# EAGLE design M661X (EAGLE 6.6.0)
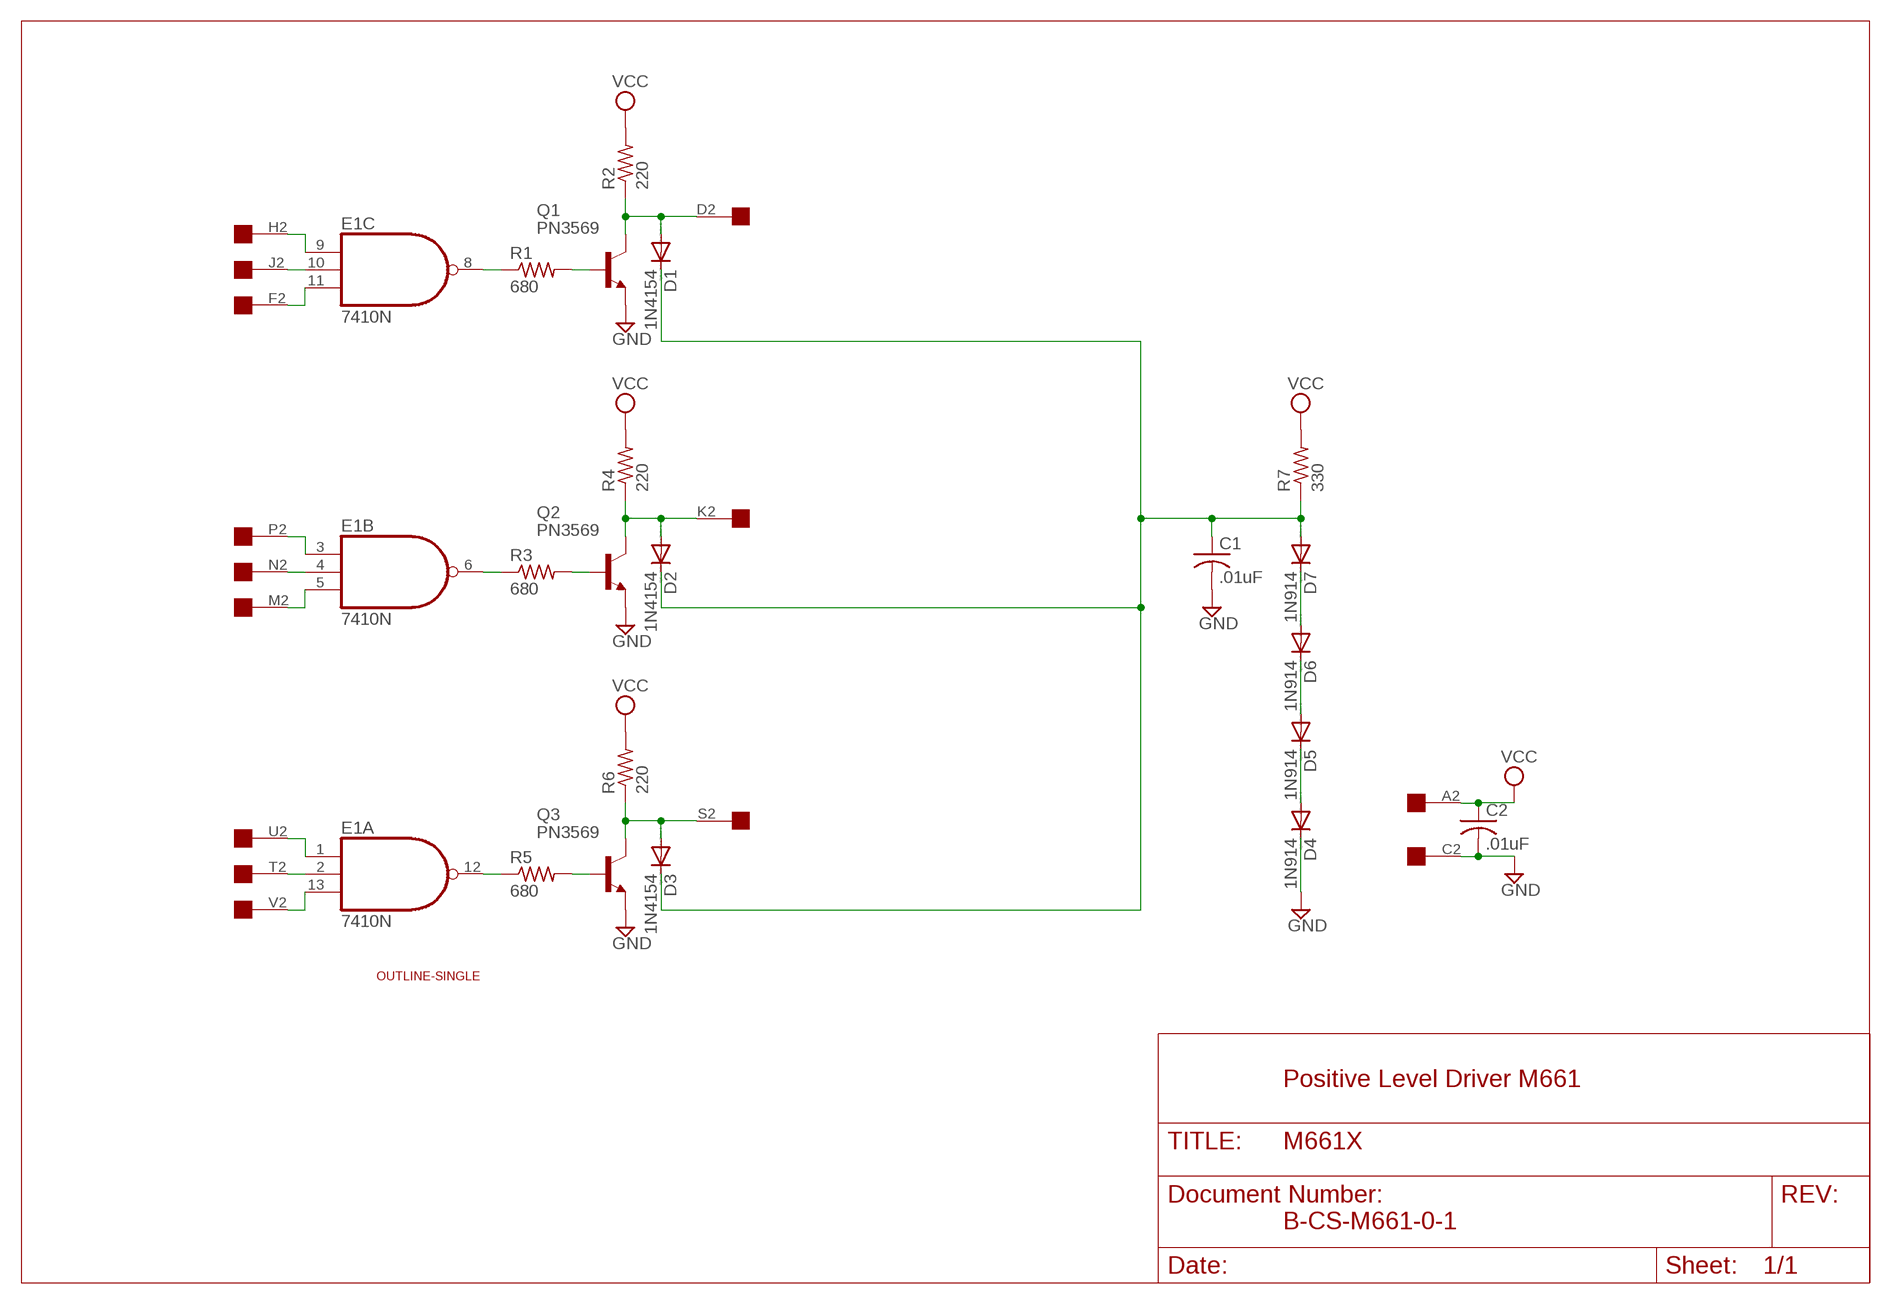
[diagram p0: schematic, sheet 1]

## Parts
C1  .01uF  C-US050-025X075  [C050-025X075]
C2  .01uF  C-US050-025X075  [C050-025X075]
D1  1N4154  1N4148DO35-10  [DO35-10]
D2  1N4154  1N4148DO35-10  [DO35-10]
D3  1N4154  1N4148DO35-10  [DO35-10]
D4  1N914  1N4148DO35-10  [DO35-10]
D5  1N914  1N4148DO35-10  [DO35-10]
D6  1N914  1N4148DO35-10  [DO35-10]
D7  1N914  1N4148DO35-10  [DO35-10]
E1  7410N  [DIL14]
Q1  PN3569  2N2219  [TO5]
Q2  PN3569  2N2219  [TO5]
Q3  PN3569  2N2219  [TO5]
R1  680  R-US_0207/10  [0207/10]
R2  220  R-US_0207/10  [0207/10]
R3  680  R-US_0207/10  [0207/10]
R4  220  R-US_0207/10  [0207/10]
R5  680  R-US_0207/10  [0207/10]
R6  220  R-US_0207/10  [0207/10]
R7  330  R-US_0207/10  [0207/10]
U$1  OUTLINE-SINGLE  [SINGLE]
U$3  EDGE-1  [EDGE-CON1]

## Nets
GND [Supply]: C1.2 C2.2 D4.C Q1.1(E) Q2.1(E) Q3.1(E) U$3.C2
N$1: E1.10(C:I1) U$3.J2
N$2: E1.9(C:I0) U$3.H2
N$3: E1.8(C:O) R1.1
N$4: Q1.2(B) R1.2
N$5: E1.4(B:I1) U$3.N2
N$6: D1.A Q1.3(C) R2.1 U$3.D2
N$7: E1.2(A:I1) U$3.T2
N$8: E1.1(A:I0) U$3.U2
N$9: E1.3(B:I0) U$3.P2
N$10: E1.6(B:O) R3.1
N$11: D2.A Q2.3(C) R4.1 U$3.K2
N$12: C1.1 D1.C D2.C D3.C D7.A R7.1
N$13: D4.A D5.C
N$14: D5.A D6.C
N$15: E1.5(B:I2) U$3.M2
N$16: Q2.2(B) R3.2
N$17: E1.12(A:O) R5.1
N$18: D3.A Q3.3(C) R6.1 U$3.S2
N$19: D6.A D7.C
N$20: E1.11(C:I2) U$3.F2
N$22: E1.13(A:I2) U$3.V2
N$23: Q3.2(B) R5.2
VCC [Supply]: C2.1 R2.2 R4.2 R6.2 R7.2 U$3.A2
Unconnected: U$3.B2 U$3.E2 U$3.L2 U$3.R2

## Notes on the sheet
- Positive Level Driver M661
- B-CS-M661-0-1

## Power pins joined to a net without a drawn wire
GND: E1.7(P:GND)
VCC: E1.14(P:VCC)

## Library data of the parts
C1 C2 = rcl:C-US: CAPACITOR, American symbol
D1-D7 = diode:1N4148: DIODE high speed (Philips)
E1 = 74xx-us:74*10: Triple 3-input NAND gate
Q1-Q3 = transistor-npn:2N2219: NPN Transistor
R1-R7 = rcl:R-US_: RESISTOR, American symbol
U$1 = dec-con:OUTLINE-*: Board outlines for DEC boards.
U$3 = dec-con:EDGE-1: Single-Sided DEC Edge Connector -- (side 2)

## Net classes
1 Supply: width 0.813 mm

## Board
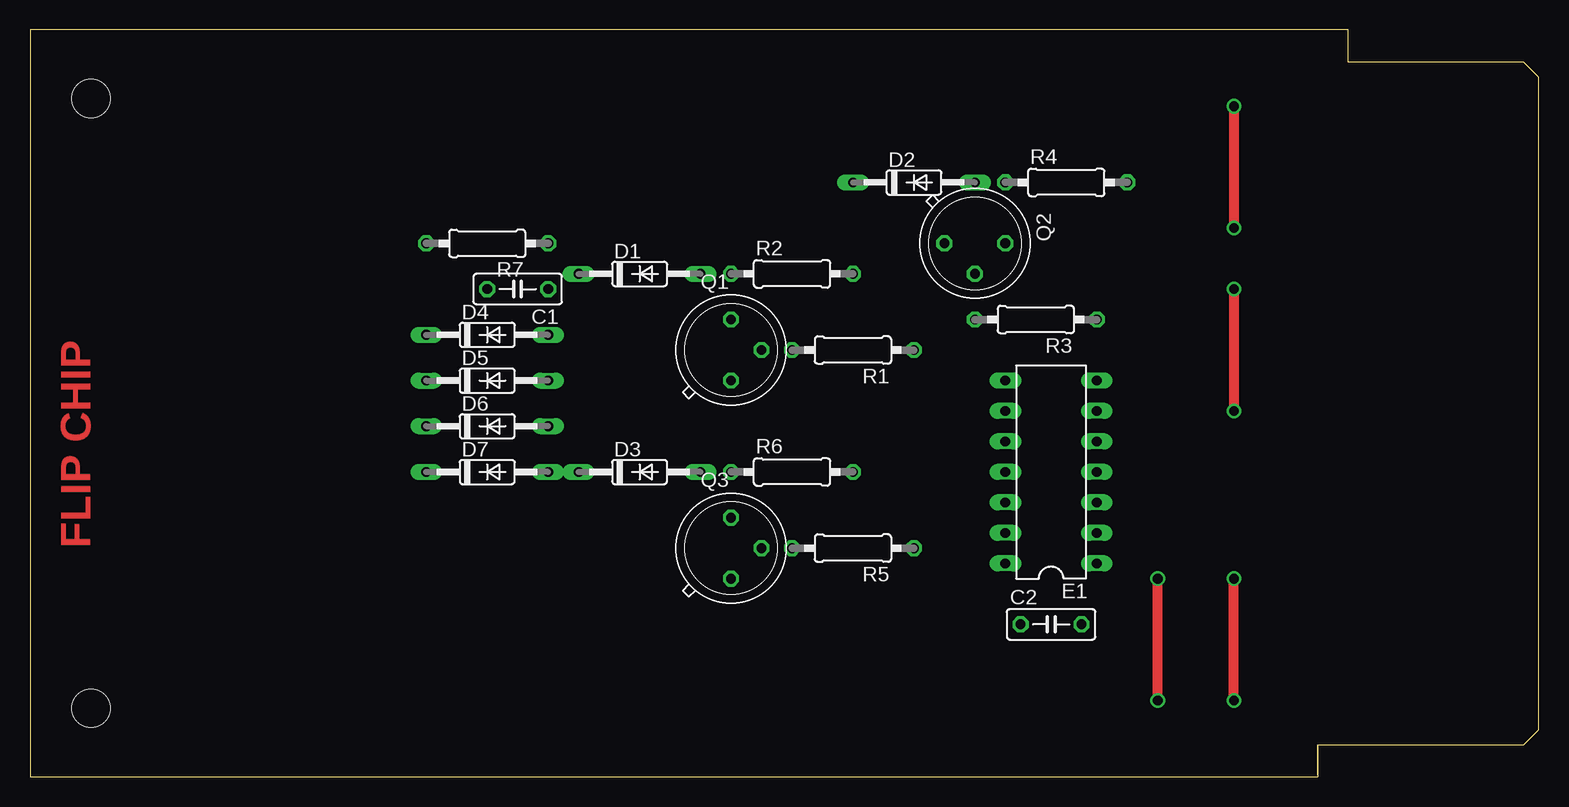
[diagram p1: board, top side]
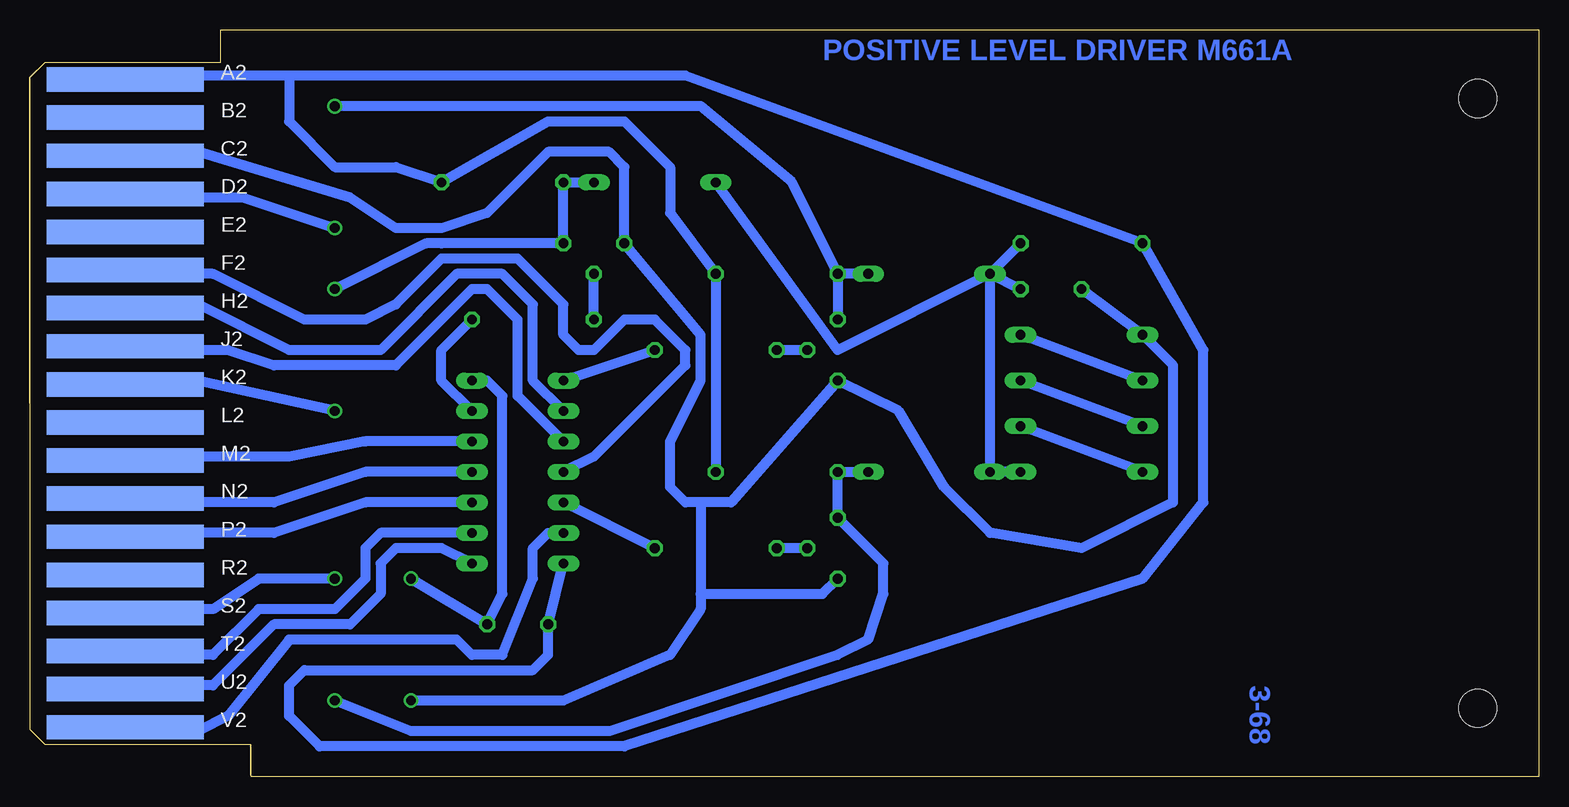
[diagram p2: board, bottom side, seen from below]

Size 125.73 x 62.23 mm. Coordinates in mm from the lower left corner, seen from the top.
Copper layers (1+16): Top 0.035mm / dielectric 1.5mm / Bottom 0.035mm
Design rules "16mils": minimum track width 16mil, minimum drill 32mil, track to track 15mil, track to pad 10mil, pad to pad 10mil, via to via 10mil, smd to smd 10mil, copper to edge 13mil, drill to drill 10mil, minimum pad ring 10mil, minimum via ring 8mil, stop-mask expansion 0mil, vias tented up to drill 0mil, thermal gap 10mil

### Footprints (pad centres in the part's own frame; a part is rotated, then mirrored left to right if it is on the bottom)
C050-025X075 = drill 0.813 octagon: 1 -2.54,0; 2 2.54,0
DO35-10 = drill 0.813 long: A 5.08,0; C -5.08,0
DIL14 = drill 0.813 long: 1 -7.62,-3.81; 2 -5.08,-3.81; 3 -2.54,-3.81; 4 0,-3.81; 5 2.54,-3.81; 6 5.08,-3.81; 7 7.62,-3.81; 8 7.62,3.81; 9 5.08,3.81; 10 2.54,3.81; 11 0,3.81; 12 -2.54,3.81; 13 -5.08,3.81; 14 -7.62,3.81
TO5 = drill 0.813 octagon: 1 0,-2.54; 2 2.54,0; 3 0,2.54
0207/10 = drill 0.813 octagon: 1 -5.08,0; 2 5.08,0
SINGLE = hole 3.175: 120.65,56.515; 120.65,5.715
EDGE-CON1 = smd 13.106 x 2.032 bottom: A2 7.938,4.128; B2 7.938,7.303; C2 7.938,10.477; D2 7.938,13.652; E2 7.938,16.828; F2 7.938,20.003; H2 7.938,23.177; J2 7.938,26.352; K2 7.938,29.527; L2 7.938,32.703; M2 7.938,35.877; N2 7.938,39.053; P2 7.938,42.227; R2 7.938,45.403; S2 7.938,48.578; T2 7.938,51.752; U2 7.938,54.928; V2 7.938,58.102

### Placement (x,y rotation side)
C1  40.64,40.64 180 top
C2  85.09,12.7 0 top
D1  50.8,41.91 0 top
D2  73.66,49.53 0 top
D3  50.8,25.4 0 top
D4  38.1,36.83 0 top
D5  38.1,33.02 0 top
D6  38.1,29.21 0 top
D7  38.1,25.4 0 top
E1  85.09,25.4 90 top
Q1  58.42,35.56 0 top
Q2  78.74,44.45 270 top
Q3  58.42,19.05 0 top
R1  68.58,35.56 180 top
R2  63.5,41.91 0 top
R3  83.82,38.1 180 top
R4  86.36,49.53 0 top
R5  68.58,19.05 180 top
R6  63.5,25.4 0 top
R7  38.1,44.45 180 top
U$1  125.73,62.23 180 top
U$2  [FLIPCHIP]  0,0 0 top
U$3  125.73,62.23 180 top

### Tracks (layer width: path | path; a pad name or v marks a point on that pad's centre or on a via)
GND  (via drill 0.81)
  Top 0.813: v93.98,6.35 v93.98,16.51
  Bottom 0.813: C1.2 D4.C 30.48,34.29 30.48,22.86 38.1,19.05 45.72,20.32 49.53,24.13 53.34,30.48 Q1.1 67.31,22.86 69.85,22.86 | U$3.C2 116.84,52.07 111.76,52.07 99.06,48.26 95.25,45.72 91.44,45.72 87.63,46.99 82.55,52.07 77.47,52.07 76.2,50.8 Q2.1 69.85,36.83 69.85,33.02 72.39,27.94 72.39,24.13 71.12,22.86 69.85,22.86 | v93.98,16.51 C2.2 86.36,15.24 86.36,31.75 87.63,33.02 E1.7 | v93.98,6.35 81.28,6.35 72.39,10.16 69.85,13.97 69.85,15.24 | 69.85,22.86 69.85,15.24 | Q3.1 59.69,15.24 69.85,15.24
N$1
  Bottom 0.813: E1.10 85.09,31.75 85.09,38.1 87.63,40.64 88.9,40.64 95.25,34.29 105.41,34.29 109.22,35.56 116.84,35.56 U$3.J2
N$2
  Bottom 0.813: E1.9 83.82,33.02 83.82,39.37 86.36,41.91 90.17,41.91 96.52,35.56 104.14,35.56 111.76,39.37 116.84,39.37 U$3.H2
N$3
  Bottom 0.813: R1.1 E1.8
N$4
  Bottom 0.813: Q1.2 R1.2
N$5
  Bottom 0.813: U$3.N2 116.84,22.86 105.41,22.86 97.79,25.4 E1.4
N$6  (via drill 0.81)
  Top 0.813: v100.33,55.88 v100.33,45.72
  Bottom 0.813: D1.A R2.1 | U$3.D2 116.84,48.26 107.95,48.26 v100.33,45.72 | v100.33,55.88 69.85,55.88 62.23,49.53 R2.1 | R2.1 Q1.3
N$7
  Bottom 0.813: E1.2 96.52,20.32 97.79,19.05 97.79,16.51 100.33,13.97 106.68,13.97 110.49,10.16 116.84,10.16 U$3.T2
N$8
  Bottom 0.813: U$3.U2 116.84,7.62 110.49,7.62 105.41,12.7 99.06,12.7 96.52,15.24 96.52,17.78 95.25,19.05 91.44,19.05 E1.1
N$9
  Bottom 0.813: E1.3 97.79,22.86 105.41,20.32 116.84,20.32 U$3.P2
N$10
  Bottom 0.813: E1.6 91.44,33.02 91.44,35.56 R3.1
N$11  (via drill 0.81)
  Top 0.813: v100.33,40.64 v100.33,30.48
  Bottom 0.813: D2.A R4.1 Q2.3 91.44,44.45 92.71,44.45 v100.33,40.64 | U$3.K2 116.84,33.02 111.76,33.02 v100.33,30.48
N$12
  Bottom 0.813: D7.A D3.C D1.C | D1.C R7.1 | D1.C C1.1 | D1.C 58.42,35.56 D2.C
N$13
  Bottom 0.813: D5.C D4.A
N$14
  Bottom 0.813: D6.C D5.A
N$15
  Bottom 0.813: U$3.M2 116.84,26.67 104.14,26.67 97.79,27.94 E1.5
N$16
  Bottom 0.813: R3.2 Q2.2
N$17
  Bottom 0.813: R5.1 E1.12
N$18  (via drill 0.81)
  Top 0.813: v100.33,6.35 v100.33,16.51
  Bottom 0.813: D3.A R6.1 Q3.3 54.61,17.78 54.61,15.24 55.88,11.43 58.42,10.16 77.47,3.81 93.98,3.81 v100.33,6.35 | U$3.S2 116.84,13.97 110.49,13.97 106.68,16.51 v100.33,16.51
N$19
  Bottom 0.813: D7.C D6.A
N$20
  Bottom 0.813: E1.11 78.74,26.67 71.12,34.29 71.12,35.56 73.66,38.1 76.2,38.1 78.74,35.56 80.01,35.56 81.28,36.83 81.28,39.37 85.09,43.18 90.17,43.18 91.44,43.18 92.71,41.91 95.25,39.37 97.79,38.1 102.87,38.1 110.49,41.91 116.84,41.91 U$3.F2
N$22
  Bottom 0.813: U$3.V2 116.84,3.81 111.76,3.81 109.22,5.08 104.14,11.43 90.17,11.43 88.9,10.16 86.36,10.16 83.82,16.51 83.82,19.05 82.55,20.32 E1.13
N$23
  Bottom 0.813: Q3.2 R5.2
VCC
  Bottom 0.813: U$3.A2 117.22,58.04 116.84,58.42 104.14,58.42 | 104.14,58.42 71.12,58.42 R7.2 27.94,35.56 27.94,22.86 33.02,16.51 76.2,2.54 101.6,2.54 104.14,5.08 104.14,7.62 102.87,8.89 83.82,8.89 82.55,10.16 C2.1 E1.14 | 104.14,58.42 104.14,54.61 100.33,50.8 95.25,50.8 R4.2 82.55,54.61 76.2,54.61 72.39,50.8 72.39,46.99 R2.2 R6.2

### Text on the board
Bottom: POSITIVE LEVEL DRIVER M661A | 3-68